# EAGLE schematic 14320^4 (EAGLE 7.6.0)

## Sheet 1 of 2
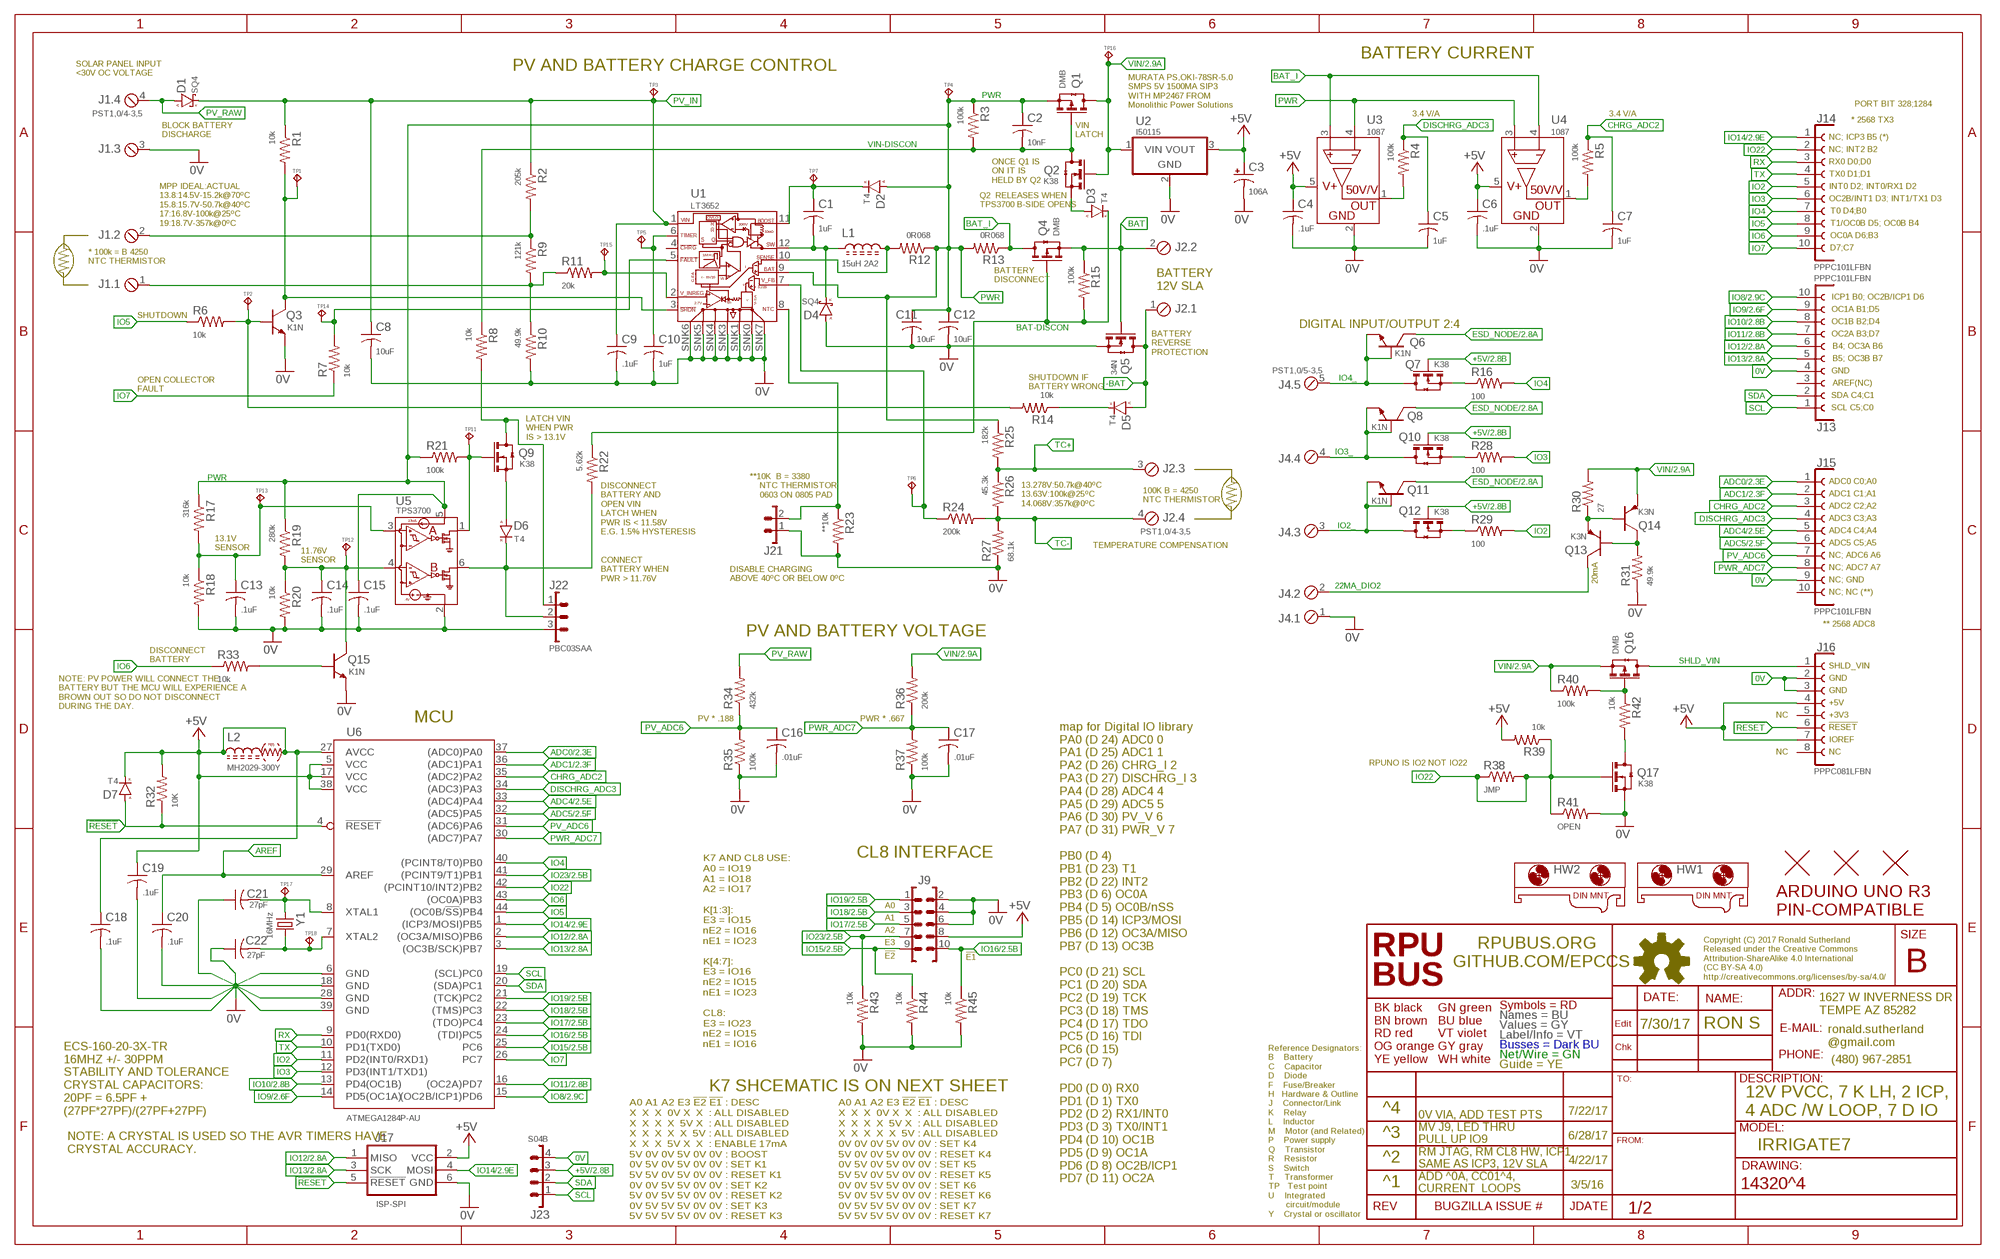
[diagram p0: schematic, sheet 1]

### Parts
C1  1uF  CC0805A  [C0805(2012)]
C2  10nF  CC0603A  [C0603(1608)]
C3  106A  CT1206  [3216]
C4  .1uF  CC0603A  [C0603(1608)]
C5  1uF  CC0805A  [C0805(2012)]
C6  .1uF  CC0603A  [C0603(1608)]
C7  1uF  CC0805A  [C0805(2012)]
C8  10uF  CC1206  [C1206(3216)]
C9  .1uF  CC0805A  [C0805(2012)]
C10  1uF  CC0805A  [C0805(2012)]
C11  10uF  CC1206  [C1206(3216)]
C12  10uF  CC1206  [C1206(3216)]
C13  .1uF  CC0603A  [C0603(1608)]
C14  .1uF  CC0603A  [C0603(1608)]
C15  .1uF  CC0603A  [C0603(1608)]
C16  .01uF  CC0603A  [C0603(1608)]
C17  .01uF  CC0603A  [C0603(1608)]
C18  .1uF  CC0603A  [C0603(1608)]
C19  .1uF  CC0603A  [C0603(1608)]
C20  .1uF  CC0603A  [C0603(1608)]
C21  27pF  CC0603A  [C0603(1608)]
C22  27pF  CC0603A  [C0603(1608)]
D1  SQ4  DSMA  [SMA]
D2  T4  DSOD123  [SOD123]
D3  T4  DSOD123  [SOD123]
D4  SQ4  DSMA  [SMA]
D5  T4  DSOD123  [SOD123]
D6  T4  DSOD123  [SOD123]
D7  T4  DSOD123  [SOD123]
HW1  MOUNT-HOLE5.0  [USA10]
HW2  MOUNT-HOLE5.0  [USA10]
HW3  ARDUINO-UNO  [ARDUINO_UNO]
J1  PST1,0/4-3,5  MCV4  [MCV4]
J2  PST1,0/4-3,5  MCV4  [MCV4]
J4  PST1,0/5-3,5  MCV5  [MCV5]
J9  2X5  [2X5]
J13  PPPC101LFBN  F1X10  [F1X10]
J14  PPPC101LFBN  F1X10  [F1X10]
J15  PPPC101LFBN  F1X10  [F1X10]
J16  PPPC081LFBN  F1X8  [F1X8]
J17  ISP-SPI  ISP-SPIPTH  [ISP]
J21  1X2  [1X2]
J22  PBC03SAA  1X3  [1X3]
J23  S04B  B04B  [B04B]
L1  15uH 2A2  L3939  [L3939]
L2  MH2029-300Y  L0805  [C0805(2012)]
Q1  DMB  N-CHSOT23  [SOT23]
Q2  K38  N-CHSOT23  [SOT23]
Q3  K1N  NPNSOT23  [SOT23]
Q4  DMB  N-CHSOT23  [SOT23]
Q5  34N  N-CHSOT23  [SOT23]
Q6  K1N  NPNSOT23  [SOT23]
Q7  K38  N-CHSOT23  [SOT23]
Q8  K1N  NPNSOT23  [SOT23]
Q9  K38  N-CHSOT23  [SOT23]
Q10  K38  N-CHSOT23  [SOT23]
Q11  K1N  NPNSOT23  [SOT23]
Q12  K38  N-CHSOT23  [SOT23]
Q13  K3N  PNPSOT23  [SOT23]
Q14  K3N  PNPSOT23  [SOT23]
Q15  K1N  NPNSOT23  [SOT23]
Q16  DMB  N-CHSOT23  [SOT23]
Q17  K38  N-CHSOT23  [SOT23]
R1  10k  R0805  [C0805(2012)]
R2  205k  R0805  [C0805(2012)]
R3  100k  R0805  [C0805(2012)]
R4  100k  R0805  [C0805(2012)]
R5  100k  R0805  [C0805(2012)]
R6  10k  R0805  [C0805(2012)]
R7  10k  R0805  [C0805(2012)]
R8  10k  R0805  [C0805(2012)]
R9  121k  R0805  [C0805(2012)]
R10  49.9k  R0805  [C0805(2012)]
R11  20k  R0805  [C0805(2012)]
R12  0R068  R1210  [C1210(3225)]
R13  0R068  R1210  [C1210(3225)]
R14  10k  R0805  [C0805(2012)]
R15  100k  R0805  [C0805(2012)]
R16  100  R0805  [C0805(2012)]
R17  316k  R0805  [C0805(2012)]
R18  10k  R0805  [C0805(2012)]
R19  280k  R0805  [C0805(2012)]
R20  10k  R0805  [C0805(2012)]
R21  100k  R0805  [C0805(2012)]
R22  5.62k  R0805  [C0805(2012)]
R23  **10k  R0805  [C0805(2012)]
R24  200k  R0805  [C0805(2012)]
R25  182k  R0805  [C0805(2012)]
R26  45.3k  R0805  [C0805(2012)]
R27  68.1k  R0805  [C0805(2012)]
R28  100  R0805  [C0805(2012)]
R29  100  R0805  [C0805(2012)]
R30  27  R0805  [C0805(2012)]
R31  49.9k  R0805  [C0805(2012)]
R32  10K  R0805  [C0805(2012)]
R33  10k  R0805  [C0805(2012)]
R34  432k  R0805  [C0805(2012)]
R35  100k  R0805  [C0805(2012)]
R36  200k  R0805  [C0805(2012)]
R37  100k  R0805  [C0805(2012)]
R38  JMP  R0805  [C0805(2012)]
R39  10k  R0805  [C0805(2012)]
R40  100k  R0805  [C0805(2012)]
R41  OPEN  R0805  [C0805(2012)]
R42  10k  R0805  [C0805(2012)]
R43  10k  R0805  [C0805(2012)]
R44  10k  R0805  [C0805(2012)]
R45  10k  R0805  [C0805(2012)]
TP1  TPPAD1-08  [P1-08]
TP2  TPPAD1-08  [P1-08]
TP3  TPPAD1-08  [P1-08]
TP4  TPPAD1-08  [P1-08]
TP5  TPPAD1-08  [P1-08]
TP6  TPPAD1-08  [P1-08]
TP7  TPPAD1-08  [P1-08]
TP11  TPPAD1-08  [P1-08]
TP12  TPPAD1-08  [P1-08]
TP13  TPPAD1-08  [P1-08]
TP14  TPPAD1-08  [P1-08]
TP15  TPPAD1-08  [P1-08]
TP16  TPPAD1-08  [P1-08]
TP17  TPPAD1-08  [P1-08]
TP18  TPPAD1-08  [P1-08]
U1  LT3652  [12MSOP-EDP-HAND]
U2  I50115  OKI-78SR-H  [OKI-78SR-H]
U3  1087  ZXCT1087  [SOT23-5]
U4  1087  ZXCT1087  [SOT23-5]
U5  TPS3700  TPS3700DDCR  [SOT23-6]
U6  ATMEGA1284P-AU  ATMEGA1284-AUTQFP44  [TQFP44]
U$2  FIDUCIAL1.27  [FIDUCIAL-1.27]
U$3  FIDUCIAL1.27  [FIDUCIAL-1.27]
U$4  FIDUCIAL1.27  [FIDUCIAL-1.27]
Y1  16MHz  CSM-3X  [CSM-3X]

### Nets
0V: C3.- C4.2 C5.2 C6.2 C7.2 C8.2 C9.2 C10.2 C11.2 C12.2 C13.2 C14.2 C15.2 C16.2 C17.2 C18.2 C19.2 C20.2 C21.1 C22.1 D4.A J1.3 J4.1 J9.2 J9.4 J9.6 J13.4 J15.9 J16.2 J16.3 J17.6(GND) J21.1 J22.3 J23.4 Q3.E Q5.2(S)(S) Q15.E Q17.2(S)(S) R10.2 R18.2 R20.2 R23.2 R27.1 R31.1 R35.1 R37.1 R41.2 R43.2 R44.2 R45.2 U1.SNK0(0V) U1.SNK1(0V) U1.SNK3(0V) U1.SNK4(0V) U1.SNK5(0V) U1.SNK6(0V) U1.SNK7(0V) U2.2(GND) U3.2(GND) U4.2(GND) U5.2(0V) U6.6(GND) U6.18(GND) U6.28(GND) U6.39(GND) ; also sheet 2
22MA_DIO2: J4.2 Q13.C
!RESET!: D7.A J16.6 J17.5(!RESET) R32.1 U6.4(!RESET)
+5V: C3.+ C4.1 C6.1 C18.1 C19.1 D7.C(K) J9.8 J16.4 J16.7 J17.2(VCC) J23.3 L2.1 L2.2 Q7.1(G)(G) Q10.1(G)(G) Q12.1(G)(G) R32.2 R39.2 U2.3(VOUT) U3.5(VCC) U4.5(VCC) U6.5(VCC) U6.17(VCC) U6.27(AVCC) U6.38(VCC) ; also sheet 2
-BAT: D5.A J2.1 Q5.3(D)(D)
ADC0: J15.1 U6.37((ADC0)PA0) ; also sheet 2
ADC1: J15.2 U6.36((ADC1)PA1) ; also sheet 2
ADC4: J15.5 U6.33((ADC4)PA4) ; also sheet 2
ADC5: J15.6 U6.32((ADC5)PA5) ; also sheet 2
AREF: C20.1 U6.29(AREF)
BAT: J2.2 Q4.2(S)(S) Q5.1(G)(G) R15.1
BAT-DISCON: D3.C(K) Q4.1(G)(G) R15.2 R22.1
BAT_I: Q4.3(D)(D) R13.1 U3.3(S+) U4.4(S-)
CHRG_ADC2: C7.1 J15.3 R5.1 U6.35((ADC2)PA2)
DISCHRG_ADC3: C5.1 J15.4 R4.1 U6.34((ADC3)PA3)
ESD_NODE: Q6.C Q8.C Q11.C ; also sheet 2
IO2: J14.5 R29.2 U6.11(PD2(INT0/RXD1))
IO2_: J4.3 Q11.B Q11.E Q12.3(D)(D)
IO3: J14.6 R28.2 U6.12(PD3(INT1/TXD1))
IO3_: J4.4 Q8.B Q8.E Q10.3(D)(D)
IO4: J14.7 R16.2 U6.40((PCINT8/T0)PB0)
IO4_: J4.5 Q6.B Q6.E Q7.3(D)(D)
IO5: J14.8 R6.1 U6.44((OC0B/!SS!)PB4)
IO6: J14.9 R33.1 U6.43((OC0A)PB3)
IO7: J14.10 R7.1 U6.26(PC7)
IO8: J13.10 U6.15((OC2B/ICP1)PD6) ; also sheet 2
IO9: J13.9 U6.14(PD5(OC1A)) ; also sheet 2
IO10: J13.8 U6.13(PD4(OC1B)) ; also sheet 2
IO11: J13.7 U6.16((OC2A)PD7) ; also sheet 2
IO12: J13.6 J17.1(MISO) U6.2((OC3A/MISO)PB6) ; also sheet 2
IO13: J13.5 J17.3(SCK) U6.3((OC3B/SCK)PB7) ; also sheet 2
IO14: J14.1 J17.4(MOSI) U6.1((ICP3/MOSI)PB5) ; also sheet 2
IO15: J9.9 R44.1 U6.25(PC6) ; also sheet 2
IO16: J9.10 R45.1 U6.24((TDI)PC5) ; also sheet 2
IO17: J9.5 U6.23((TDO)PC4) ; also sheet 2
IO18: J9.3 U6.22((TMS)PC3) ; also sheet 2
IO19: J9.1 U6.21((TCK)PC2) ; also sheet 2
IO22: J14.2 Q17.1(G)(G) R38.1 R38.2 R39.1 R41.1 U6.42((PCINT10/INT2)PB2)
IO23: J9.7 R43.1 U6.41((PCINT9/T1)PB1) ; also sheet 2
N$2: R24.1 TP6.TP U1.7(V_FB)
N$5: Q16.1(G)(G) R40.2 R42.1
N$6: Q17.3(D)(D) R42.2
N$8: R4.2 U3.1(OUT)
N$10: C1.1 D2.C(K) TP7.TP U1.11(BOOST)
N$23: C10.1 TP5.TP U1.6(TIMER)
N$28: R5.2 U4.1(OUT)
N$38: D5.C(K) R14.1
N$39: J1.1 R9.2 R10.1 R11.1
N$40: Q3.C R1.2 TP1.TP U1.3(!SHDN)
N$46: Q3.B R6.2 R14.2 TP2.TP
N$49: Q15.B R33.2
N$54: C14.1 Q15.C R19.2 R20.1 TP12.TP U5.4(INB)
N$55: D3.A Q2.2(S)(S)
N$56: J1.2 R2.2 R9.1
N$57: D6.A Q9.2(S)(S)
N$62: C13.1 R17.2 R18.1 TP13.TP U5.3(INA)
N$63: Q9.1(G)(G) R21.2 TP11.TP U5.1(OUTA)
N$64: D6.C(K) J22.2 R22.2 U5.6(OUTB)
N$65: J22.1 Q9.3(D)(D) R8.2
N$70: R11.2 TP15.TP U1.2(V_INREG)
N$91: Q13.E Q14.B R30.1
N$93: Q10.2(S)(S) R28.1
N$97: Q13.B Q14.C R31.2
N$104: Q7.2(S)(S) R16.1
N$109: R7.2 TP14.TP U1.5(!FAULT)
N$110: Q12.2(S)(S) R29.1
N$115: C21.2 TP17.TP U6.8(XTAL1) Y1.1
N$116: C22.2 TP18.TP U6.7(XTAL2) Y1.2
NTC1: J21.2 R23.1 U1.8(NTC)
PV_ADC6: C16.1 J15.7 R34.1 R35.2 U6.31((ADC6)PA6)
PV_IN: C8.1 C9.1 D1.K R1.1 R2.1 TP3.TP U1.1(VIN)
PV_RAW: D1.A J1.4 R34.2
PWR: C2.1 C11.1 C12.1 C15.1 D2.A Q1.2(S)(S) R3.1 R12.1 R13.2 R17.1 R19.1 R21.1 R25.1 TP4.TP U1.9(BAT) U3.4(S-) U4.3(S+) U5.5(VDD)
PWR_ADC7: C17.1 J15.8 R36.1 R37.2 U6.30((ADC7)PA7)
RX: J14.3 U6.9(PD0(RXD0))
SCL: J13.1 J23.1 U6.19((SCL)PC0)
SDA: J13.2 J23.2 U6.20((SDA)PC1)
SENSE1: L1.2 R12.2 U1.10(SENSE)
SHLD_VIN: J16.1 Q16.3(D)(D)
SW: C1.2 D4.K L1.1 U1.12(SW)
TC+: J2.3 R25.2 R26.1
TC-: J2.4 R24.2 R26.2 R27.2
TX: J14.4 U6.10(PD1(TXD0))
VIN: Q1.3(D)(D) Q2.1(G)(G) Q14.E Q16.2(S)(S) R30.2 R36.2 R40.1 TP16.TP U2.1(VIN) ; also sheet 2
VIN-DISCON: C2.2 Q1.1(G)(G) Q2.3(D)(D) R3.2 R8.1
Unconnected: J13.3 J15.10 J16.5 J16.8 U1.4(!CHRG)

### Notes on the sheet
- BATTERY CURRENT
- PV AND BATTERY CHARGE CONTROL
- SOLAR PANEL INPUT
  <30V OC VOLTAGE
- PORT BIT 328;1284
- MURATA PS,OKI-78SR-5.0
  SMPS 5V 1500MA SIP3
  WITH MP2467 FROM 
  Monolithic Power Solutions
- 3.4 V/A | 3.4 V/A
- * 2568 TX3
- BLOCK BATTERY
  DISCHARGE
- VIN
  LATCH
- NC; ICP3 B5 (*)
- NC; INT2 B2
- RX0 D0;D0
- TX0 D1;D1
- ONCE Q1 IS 
  ON IT IS 
  HELD BY Q2
- INT0 D2; INT0/RX1 D2
- OC2B/INT1 D3; INT1/TX1 D3
- Q2  RELEASES WHEN 
  TPS3700 B-SIDE OPENS
- T0 D4;B0
- MPP IDEAL:ACTUAL
  13.8:14.5V-15.2k@70ºC
  15.8:15.7V-50.7k@40ºC
  17:16.8V-100k@25ºC
  19:18.7V-357k@0ºC
- T1/OC0B D5; OC0B B4
- OC0A D6;B3
- D7;C7
- * 100k = B 4250
  NTC THERMISTOR
- BATTERY
  DISCONNECT
- BATTERY
  12V SLA
- ICP1 B0; OC2B/ICP1 D6
- OC1A B1;D5
- SHUTDOWN
- OC1B B2;D4
- DIGITAL INPUT/OUTPUT 2:4
- OC2A B3;D7
- B4; OC3A B6
- BATTERY
  REVERSE 
  PROTECTION
- B5; OC3B B7
- GND
- AREF(NC)
- SHUTDOWN IF
  BATTERY WRONG
- OPEN COLLECTOR
  FAULT
- SDA C4;C1
- SCL C5;C0
- LATCH VIN
  WHEN PWR 
  IS > 13.1V
- ADC0 C0;A0
- ADC1 C1;A1
- **10K  B = 3380
      NTC THERMISTOR
      0603 ON 0805 PAD
- 100K B = 4250
  NTC THERMISTOR
- 13.278V:50.7k@40ºC 
  13.63V:100k@25ºC
  14.068V:357k@0ºC
- ADC2 C2;A2
- ADC3 C3;A3
- ADC4 C4;A4
- DISCONNECT 
  BATTERY AND 
  OPEN VIN 
  LATCH WHEN 
  PWR IS < 11.58V
  E.G. 1.5% HYSTERESIS
- TEMPERATURE COMPENSATION | ADC5 C5;A5
- 13.1V
  SENSOR
- NC; ADC6 A6
- 11.76V 
  SENSOR
- NC; ADC7 A7
- CONNECT 
  BATTERY WHEN
  PWR > 11.76V
- DISABLE CHARGING
  ABOVE 40ºC OR BELOW 0ºC
- 20mA | NC; GND
- NC; NC (**)
- ** 2568 ADC8
- PV AND BATTERY VOLTAGE
- DISCONNECT 
  BATTERY
- SHLD_VIN
- GND
- GND
- +5V
- NOTE: PV POWER WILL CONNECT THE 
  BATTERY BUT THE MCU WILL EXPERIENCE A
  BROWN OUT SO DO NOT DISCONNECT 
  DURING THE DAY.
- NC | +3V3
- MCU | PV * .188 | PWR * .667
- !RESET
- IOREF
- NC | NC
- RPUNO IS IO2 NOT IO22
- CL8 INTERFACE
- A0
- A1
- A2
- E3
- !E2 | !E1
- 7/30/17 | RON S
- K7 AND CL8 USE:    
  A0 = IO19
  A1 = IO18
  A2 = IO17
  
  K[1:3]:
  E3 = IO15
  nE2 = IO16
  nE1 = IO23
  
  K[4:7]:
  E3 = IO16
  nE2 = IO15
  nE1 = IO23
  
  CL8:
  E3 = IO23
  nE2 = IO15
  nE1 = IO16
- K7 SHCEMATIC IS ON NEXT SHEET
- ^4
- ECS-160-20-3X-TR
  16MHZ +/- 30PPM
  STABILITY AND TOLERANCE
  CRYSTAL CAPACITORS:
  20PF = 6.5PF +
  (27PF*27PF)/(27PF+27PF)
- 7/22/17
- 12V PVCC, 7 K LH, 2 ICP, 
  4 ADC /W LOOP, 7 D IO
- 0V VIA, ADD TEST PTS
- ^3 | 6/28/17
- MV J9, LED THRU
  PULL UP IO9
- IRRIGATE7
- NOTE: A CRYSTAL IS USED SO THE AVR TIMERS HAVE 
  CRYSTAL ACCURACY.
- ^2 | 4/22/17
- RM JTAG, RM CL8 HW, ICP1
  SAME AS ICP3, 12V SLA
- map for Digital IO library
  PA0 (D 24) ADC0 0 
  PA1 (D 25) ADC1 1
  PA2 (D 26) CHRG_I 2
  PA3 (D 27) DISCHRG_I 3
  PA4 (D 28) ADC4 4
  PA5 (D 29) ADC5 5
  PA6 (D 30) PV_V 6
  PA7 (D 31) PWR_V 7
  
  PB0 (D 4)
  PB1 (D 23) T1
  PB2 (D 22) INT2 
  PB3 (D 6) OC0A 
  PB4 (D 5) OC0B/nSS
  PB5 (D 14) ICP3/MOSI
  PB6 (D 12) OC3A/MISO
  PB7 (D 13) OC3B
     
  PC0 (D 21) SCL
  PC1 (D 20) SDA
  PC2 (D 19) TCK
  PC3 (D 18) TMS
  PC4 (D 17) TDO
  PC5 (D 16) TDI
  PC6 (D 15) 
  PC7 (D 7) 
  
  PD0 (D 0) RX0
  PD1 (D 1) TX0
  PD2 (D 2) RX1/INT0
  PD3 (D 3) TX0/INT1
  PD4 (D 10) OC1B
  PD5 (D 9) OC1A
  PD6 (D 8) OC2B/ICP1
  PD7 (D 11) OC2A
- ^1 | 3/5/16
- ADD ^0A, CC01^4, 
  CURRENT  LOOPS
- A0 A1 A2 E3 !E2! !E1! : DESC
   X  X  X  0V X  X  : ALL DISABLED
   X  X  X  X  5V X  : ALL DISABLED
   X  X  X  X  X  5V : ALL DISABLED
   X  X  X  5V X  X  : ENABLE 17mA
   5V 0V 0V 5V 0V 0V : BOOST
   0V 5V 0V 5V 0V 0V : SET K1
   5V 5V 0V 5V 0V 0V : RESET K1
   0V 0V 5V 5V 0V 0V : SET K2
   5V 0V 5V 5V 0V 0V : RESET K2
   0V 5V 5V 5V 0V 0V : SET K3
   5V 5V 5V 5V 0V 0V : RESET K3
- A0 A1 A2 E3 !E2! !E1! : DESC
   X  X  X  0V X  X  : ALL DISABLED
   X  X  X  X  5V X  : ALL DISABLED
   X  X  X  X  X  5V : ALL DISABLED
   0V 0V 0V 5V 0V 0V : SET K4
   5V 0V 0V 5V 0V 0V : RESET K4
   0V 5V 0V 5V 0V 0V : SET K5
   5V 5V 0V 5V 0V 0V : RESET K5
   0V 0V 5V 5V 0V 0V : SET K6
   5V 0V 5V 5V 0V 0V : RESET K6
   0V 5V 5V 5V 0V 0V : SET K7
   5V 5V 5V 5V 0V 0V : RESET K7

## Sheet 2 of 2
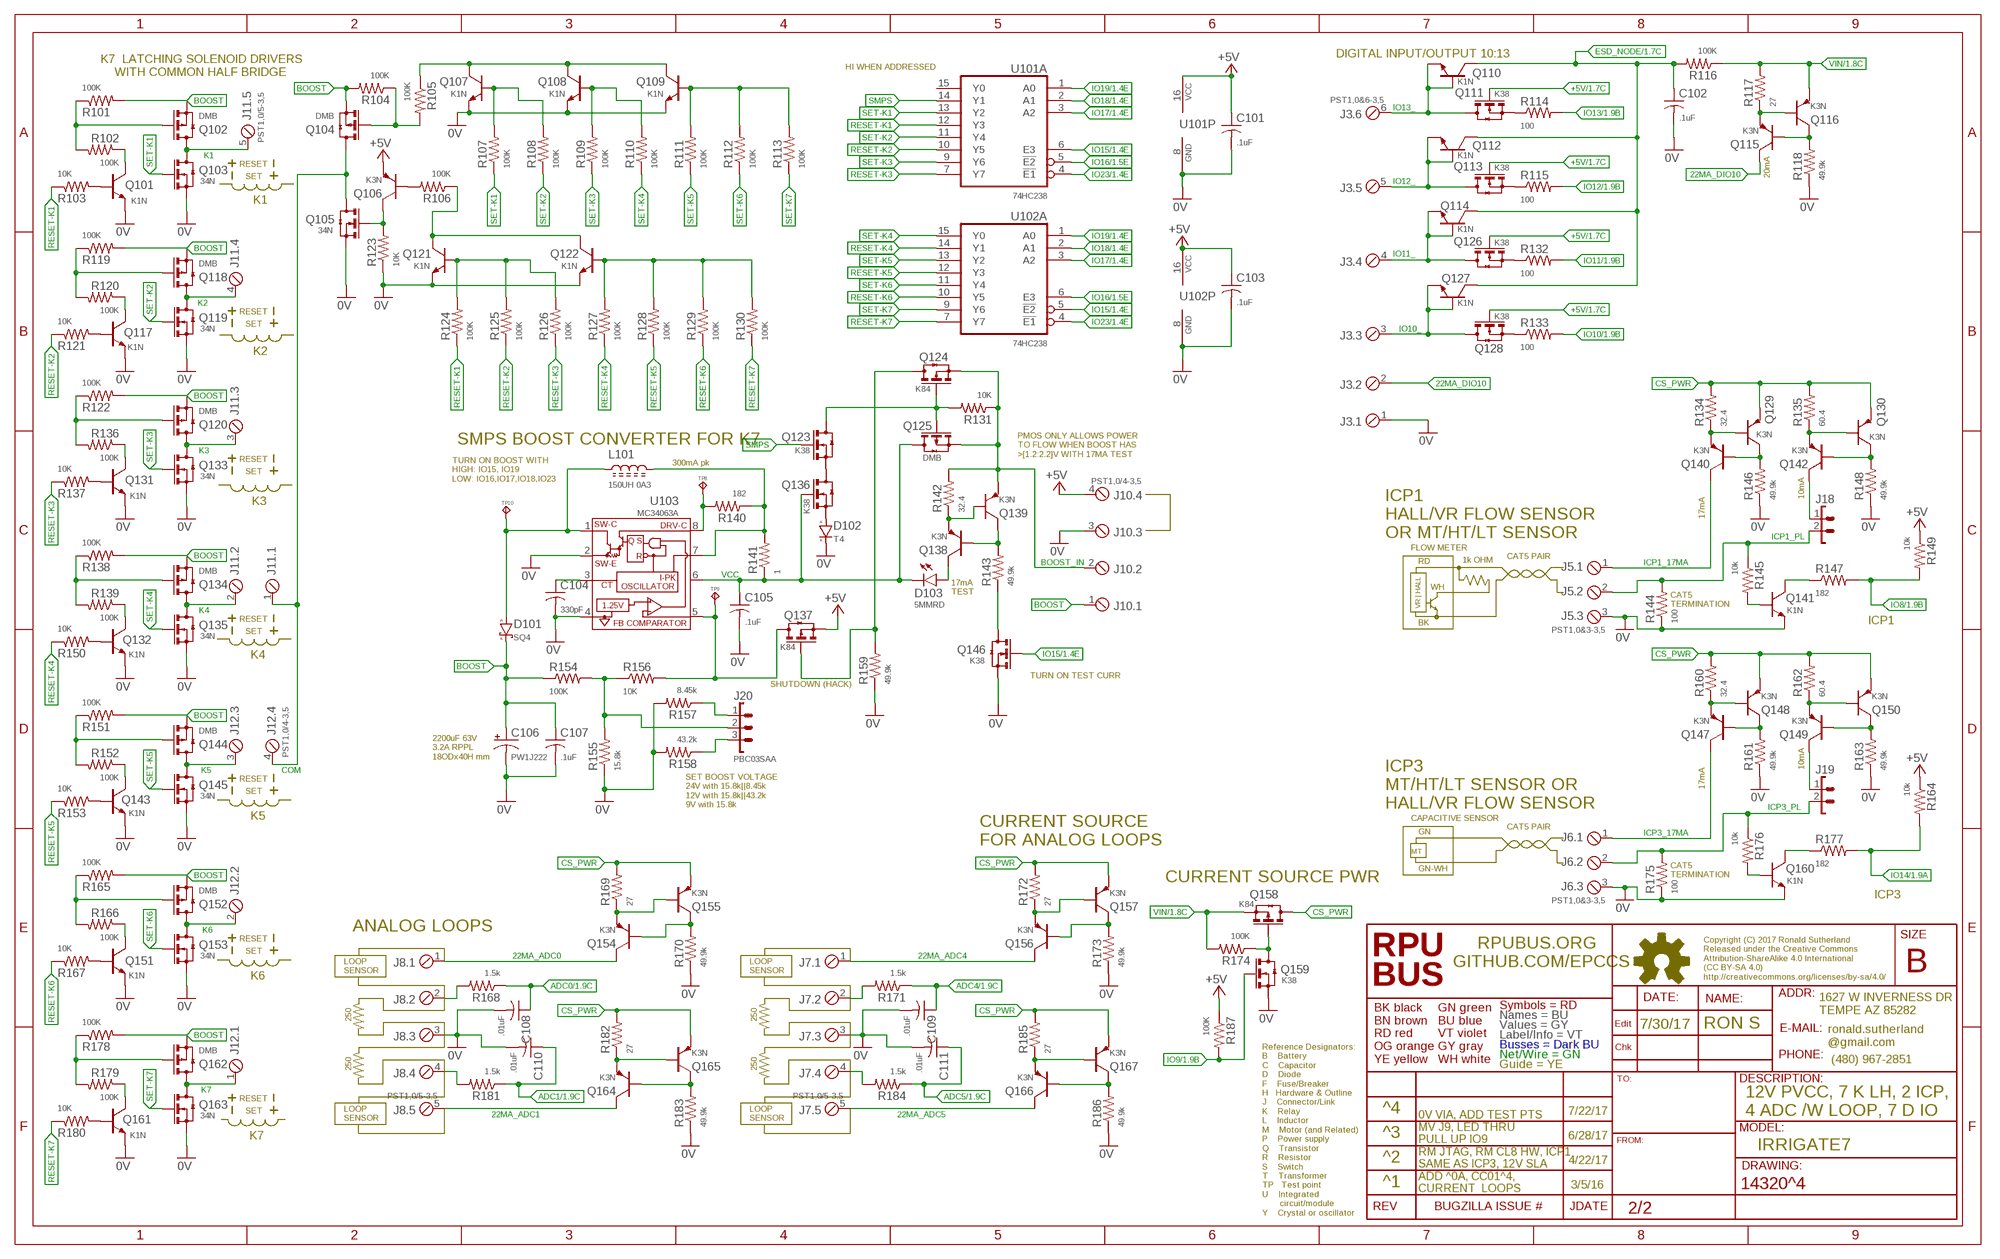
[diagram p1: schematic, sheet 2]

### Parts
C101  .1uF  CC0603A  [C0603(1608)]
C102  .1uF  CC0603A  [C0603(1608)]
C103  .1uF  CC0603A  [C0603(1608)]
C104  330pF  CC0603A  [C0603(1608)]
C105  .1uF  CC0603A  [C0603(1608)]
C106  PW1J222  C-AL7.5X18  [E7,5-18]
C107  .1uF  CC0603A  [C0603(1608)]
C108  .01uF  CC0603A  [C0603(1608)]
C109  .01uF  CC0603A  [C0603(1608)]
C110  .01uF  CC0603A  [C0603(1608)]
C111  .01uF  CC0603A  [C0603(1608)]
D101  SQ4  DSMA  [SMA]
D102  T4  DSOD123  [SOD123]
D103  5MMRD  LED5MM  [LED5MM]
J3  PST1,0&6-3,5  MCV6  [MCV6]
J5  PST1,0&3-3,5  MCV3  [MCV3]
J6  PST1,0&3-3,5  MCV3  [MCV3]
J7  PST1,0/5-3,5  MCV5  [MCV5]
J8  PST1,0/5-3,5  MCV5  [MCV5]
J10  PST1,0/4-3,5  MCV4  [MCV4]
J11  PST1,0/5-3,5  MCV5  [MCV5]
J12  PST1,0/4-3,5  MCV4  [MCV4]
J18  1X2  [1X2]
J19  1X2  [1X2]
J20  PBC03SAA  1X3  [1X3]
L101  150UH 0A3  L2626  [L2626]
Q101  K1N  NPNSOT23  [SOT23]
Q102  DMB  N-CHSOT23  [SOT23]
Q103  34N  N-CHSOT23  [SOT23]
Q104  DMB  N-CHSOT23  [SOT23]
Q105  34N  N-CHSOT23  [SOT23]
Q106  K3N  PNPSOT23  [SOT23]
Q107  K1N  NPNSOT23  [SOT23]
Q108  K1N  NPNSOT23  [SOT23]
Q109  K1N  NPNSOT23  [SOT23]
Q110  K1N  NPNSOT23  [SOT23]
Q111  K38  N-CHSOT23  [SOT23]
Q112  K1N  NPNSOT23  [SOT23]
Q113  K38  N-CHSOT23  [SOT23]
Q114  K1N  NPNSOT23  [SOT23]
Q115  K3N  PNPSOT23  [SOT23]
Q116  K3N  PNPSOT23  [SOT23]
Q117  K1N  NPNSOT23  [SOT23]
Q118  DMB  N-CHSOT23  [SOT23]
Q119  34N  N-CHSOT23  [SOT23]
Q120  DMB  N-CHSOT23  [SOT23]
Q121  K1N  NPNSOT23  [SOT23]
Q122  K1N  NPNSOT23  [SOT23]
Q123  K38  N-CHSOT23  [SOT23]
Q124  K84  N-CHSOT23  [SOT23]
Q125  DMB  N-CHSOT23  [SOT23]
Q126  K38  N-CHSOT23  [SOT23]
Q127  K1N  NPNSOT23  [SOT23]
Q128  K38  N-CHSOT23  [SOT23]
Q129  K3N  PNPSOT23  [SOT23]
Q130  K3N  PNPSOT23  [SOT23]
Q131  K1N  NPNSOT23  [SOT23]
Q132  K1N  NPNSOT23  [SOT23]
Q133  34N  N-CHSOT23  [SOT23]
Q134  DMB  N-CHSOT23  [SOT23]
Q135  34N  N-CHSOT23  [SOT23]
Q136  K38  N-CHSOT23  [SOT23]
Q137  K84  N-CHSOT23  [SOT23]
Q138  K3N  PNPSOT23  [SOT23]
Q139  K3N  PNPSOT23  [SOT23]
Q140  K3N  PNPSOT23  [SOT23]
Q141  K1N  NPNSOT23  [SOT23]
Q142  K3N  PNPSOT23  [SOT23]
Q143  K1N  NPNSOT23  [SOT23]
Q144  DMB  N-CHSOT23  [SOT23]
Q145  34N  N-CHSOT23  [SOT23]
Q146  K38  N-CHSOT23  [SOT23]
Q147  K3N  PNPSOT23  [SOT23]
Q148  K3N  PNPSOT23  [SOT23]
Q149  K3N  PNPSOT23  [SOT23]
Q150  K3N  PNPSOT23  [SOT23]
Q151  K1N  NPNSOT23  [SOT23]
Q152  DMB  N-CHSOT23  [SOT23]
Q153  34N  N-CHSOT23  [SOT23]
Q154  K3N  PNPSOT23  [SOT23]
Q155  K3N  PNPSOT23  [SOT23]
Q156  K3N  PNPSOT23  [SOT23]
Q157  K3N  PNPSOT23  [SOT23]
Q158  K84  N-CHSOT23  [SOT23]
Q159  K38  N-CHSOT23  [SOT23]
Q160  K1N  NPNSOT23  [SOT23]
Q161  K1N  NPNSOT23  [SOT23]
Q162  DMB  N-CHSOT23  [SOT23]
Q163  34N  N-CHSOT23  [SOT23]
Q164  K3N  PNPSOT23  [SOT23]
Q165  K3N  PNPSOT23  [SOT23]
Q166  K3N  PNPSOT23  [SOT23]
Q167  K3N  PNPSOT23  [SOT23]
R101  100K  R0805  [C0805(2012)]
R102  100K  R0805  [C0805(2012)]
R103  10K  R0805  [C0805(2012)]
R104  100K  R0805  [C0805(2012)]
R105  100K  R0805  [C0805(2012)]
R106  100K  R0805  [C0805(2012)]
R107  100K  R0805  [C0805(2012)]
R108  100K  R0805  [C0805(2012)]
R109  100K  R0805  [C0805(2012)]
R110  100K  R0805  [C0805(2012)]
R111  100K  R0805  [C0805(2012)]
R112  100K  R0805  [C0805(2012)]
R113  100K  R0805  [C0805(2012)]
R114  100  R0805  [C0805(2012)]
R115  100  R0805  [C0805(2012)]
R116  100K  R0805  [C0805(2012)]
R117  27  R0805  [C0805(2012)]
R118  49.9k  R0805  [C0805(2012)]
R119  100K  R0805  [C0805(2012)]
R120  100K  R0805  [C0805(2012)]
R121  10K  R0805  [C0805(2012)]
R122  100K  R0805  [C0805(2012)]
R123  10K  R0805  [C0805(2012)]
R124  100K  R0805  [C0805(2012)]
R125  100K  R0805  [C0805(2012)]
R126  100K  R0805  [C0805(2012)]
R127  100K  R0805  [C0805(2012)]
R128  100K  R0805  [C0805(2012)]
R129  100K  R0805  [C0805(2012)]
R130  100K  R0805  [C0805(2012)]
R131  10K  R0805  [C0805(2012)]
R132  100  R0805  [C0805(2012)]
R133  100  R0805  [C0805(2012)]
R134  32.4  R0805  [C0805(2012)]
R135  60.4  R0805  [C0805(2012)]
R136  100K  R0805  [C0805(2012)]
R137  10K  R0805  [C0805(2012)]
R138  100K  R0805  [C0805(2012)]
R139  100K  R0805  [C0805(2012)]
R140  182  R0805  [C0805(2012)]
R141  1  R1210  [C1210(3225)]
R142  32.4  R0805  [C0805(2012)]
R143  49.9k  R0805  [C0805(2012)]
R144  100  R0805  [C0805(2012)]
R145  10k  R0805  [C0805(2012)]
R146  49.9k  R0805  [C0805(2012)]
R147  182  R0805  [C0805(2012)]
R148  49.9k  R0805  [C0805(2012)]
R149  10k  R0805  [C0805(2012)]
R150  10K  R0805  [C0805(2012)]
R151  100K  R0805  [C0805(2012)]
R152  100K  R0805  [C0805(2012)]
R153  10K  R0805  [C0805(2012)]
R154  100K  R0805  [C0805(2012)]
R155  15.8k  R0805  [C0805(2012)]
R156  10K  R0805  [C0805(2012)]
R157  8.45k  R0805  [C0805(2012)]
R158  43.2k  R0805  [C0805(2012)]
R159  49.9k  R0805  [C0805(2012)]
R160  32.4  R0805  [C0805(2012)]
R161  49.9k  R0805  [C0805(2012)]
R162  60.4  R0805  [C0805(2012)]
R163  49.9k  R0805  [C0805(2012)]
R164  10k  R0805  [C0805(2012)]
R165  100K  R0805  [C0805(2012)]
R166  100K  R0805  [C0805(2012)]
R167  10K  R0805  [C0805(2012)]
R168  1.5k  R0805  [C0805(2012)]
R169  27  R0805  [C0805(2012)]
R170  49.9k  R0805  [C0805(2012)]
R171  1.5k  R0805  [C0805(2012)]
R172  27  R0805  [C0805(2012)]
R173  49.9k  R0805  [C0805(2012)]
R174  100K  R0805  [C0805(2012)]
R175  100  R0805  [C0805(2012)]
R176  10k  R0805  [C0805(2012)]
R177  182  R0805  [C0805(2012)]
R178  100K  R0805  [C0805(2012)]
R179  100K  R0805  [C0805(2012)]
R180  10K  R0805  [C0805(2012)]
R181  1.5k  R0805  [C0805(2012)]
R182  27  R0805  [C0805(2012)]
R183  49.9k  R0805  [C0805(2012)]
R184  1.5k  R0805  [C0805(2012)]
R185  27  R0805  [C0805(2012)]
R186  49.9k  R0805  [C0805(2012)]
R187  100K  R0805  [C0805(2012)]
TP8  TPPAD1-08  [P1-08]
TP9  TPPAD1-08  [P1-08]
TP10  TPPAD1-08  [P1-08]
U101  74HC238  74238D  [16SOIC]
U102  74HC238  74238D  [16SOIC]
U103  MC34063A  [SOIC8]

### Nets
0V: C101.2 C102.2 C103.2 C104.2 C105.2 C106.- C107.2 C108.2 C109.2 C110.2 C111.2 D102.C(K) J3.1 J5.3 J6.3 J7.3 J8.3 J10.3 Q101.E Q103.2(S)(S) Q105.2(S)(S) Q107.E Q108.E Q109.E Q117.E Q119.2(S)(S) Q121.E Q122.E Q131.E Q132.E Q133.2(S)(S) Q135.2(S)(S) Q141.E Q143.E Q145.2(S)(S) Q146.2(S)(S) Q151.E Q153.2(S)(S) Q159.2(S)(S) Q160.E Q161.E Q163.2(S)(S) R118.1 R123.1 R144.1 R146.1 R148.1 R155.1 R157.2 R158.2 R159.1 R161.1 R163.1 R170.1 R173.1 R175.1 R183.1 R186.1 U101.8(P:GND) U102.8(P:GND) U103.2(SW-E) U103.4(GND) ; also sheet 1
22MA_ADC0: J8.1 Q154.C
22MA_ADC1: J8.5 Q164.C
22MA_ADC4: J7.1 Q156.C
22MA_ADC5: J7.5 Q166.C
22MA_DIO10: J3.2 Q115.C
+5V: C101.1 C103.1 J10.4 Q106.E Q111.1(G)(G) Q113.1(G)(G) Q126.1(G)(G) Q128.1(G)(G) Q137.2(S)(S) R149.1 R164.1 R187.1 U101.16(P:VCC) U102.16(P:VCC) ; also sheet 1
ADC0: C108.1 R168.1 ; also sheet 1
ADC1: C110.1 R181.1 ; also sheet 1
ADC4: C109.1 R171.1 ; also sheet 1
ADC5: C111.1 R184.1 ; also sheet 1
BOOST: C106.+ C107.1 D101.K J10.1 Q102.2(S)(S) Q104.2(S)(S) Q118.2(S)(S) Q120.2(S)(S) Q134.2(S)(S) Q144.2(S)(S) Q152.2(S)(S) Q162.2(S)(S) R101.2 R104.2 R119.2 R122.2 R138.2 R151.2 R154.1 R165.2 R178.2
BOOST17MA: Q146.3(D)(D) R143.1
BOOST_IN: J10.2 Q124.2(S)(S) Q125.2(S)(S) Q139.E R131.1 R142.2
COM: J11.1 J12.4 Q104.3(D)(D) Q105.3(D)(D)
CS_PWR: Q129.E Q130.E Q148.E Q150.E Q155.E Q157.E Q158.3(D)(D) Q165.E Q167.E R134.2 R135.2 R160.2 R162.2 R169.2 R172.2 R182.2 R185.2
ESD_NODE: C102.1 Q110.C Q112.C Q114.C Q127.C R116.2 ; also sheet 1
ICP1_17MA: J5.1 Q140.C
ICP1_PL: J5.2 J18.2 R144.2 R145.1
ICP3_17MA: J6.1 Q147.C
ICP3_PL: J6.2 J19.2 R175.2 R176.1
IO8: R147.2 R149.2 ; also sheet 1
IO9: Q159.1(G)(G) R187.2 ; also sheet 1
IO10: R133.2 ; also sheet 1
IO10_: J3.3 Q127.B Q127.E Q128.3(D)(D)
IO11: R132.2 ; also sheet 1
IO11_: J3.4 Q114.B Q114.E Q126.3(D)(D)
IO12: R115.2 ; also sheet 1
IO12_: J3.5 Q112.B Q112.E Q113.3(D)(D)
IO13: R114.2 ; also sheet 1
IO13_: J3.6 Q110.B Q110.E Q111.3(D)(D)
IO14: R164.2 R177.2 ; also sheet 1
IO15: Q146.1(G)(G) U101.6(A:E3) U102.5(A:!E2) ; also sheet 1
IO16: U101.5(A:!E2) U102.6(A:E3) ; also sheet 1
IO17: U101.3(A:A2) U102.3(A:A2) ; also sheet 1
IO18: U101.2(A:A1) U102.2(A:A1) ; also sheet 1
IO19: U101.1(A:A0) U102.1(A:A0) ; also sheet 1
IO23: U101.4(A:!E1) U102.4(A:!E1) ; also sheet 1
K1: J11.5 Q102.3(D)(D) Q103.3(D)(D)
K2: J11.4 Q118.3(D)(D) Q119.3(D)(D)
K3: J11.3 Q120.3(D)(D) Q133.3(D)(D)
K4: J11.2 Q134.3(D)(D) Q135.3(D)(D)
K5: J12.3 Q144.3(D)(D) Q145.3(D)(D)
K6: J12.2 Q152.3(D)(D) Q153.3(D)(D)
K7: J12.1 Q162.3(D)(D) Q163.3(D)(D)
N$1: Q123.2(S)(S) Q136.3(D)(D)
N$3: Q124.3(D)(D) Q137.1(G)(G) R159.2
N$4: D102.A Q136.2(S)(S)
N$7: Q137.3(D)(D) R156.2 TP9.TP U103.5(FB)
N$9: Q104.1(G)(G) R104.1 R105.2
N$11: Q154.E Q155.B R169.1
N$12: Q129.B Q140.E R134.1
N$13: R140.2 TP8.TP U103.8(DRV-C)
N$14: L101.2 R140.1 R141.2 U103.7(I-PK)
N$15: D101.A L101.1 TP10.TP U103.1(SW-C)
N$16: C104.1 U103.3(CT)
N$17: Q129.C Q140.B R146.2
N$18: Q130.B Q142.E R135.1
N$19: J19.1 Q149.C
N$20: Q130.C Q142.B R148.2
N$21: Q105.1(G)(G) Q106.C R123.2
N$22: Q123.3(D)(D) Q124.1(G)(G) Q125.1(G)(G) R131.2
N$24: Q154.B Q155.C R170.2
N$25: J8.2 R168.2
N$26: J20.2 R154.2 R155.2 R156.1
N$27: Q107.C Q108.C Q109.C R105.1
N$29: Q109.B R111.2 R112.2 R113.2
N$32: Q108.B R109.2 R110.2
N$35: Q102.1(G)(G) R101.1 R102.2
N$36: Q101.C R102.1
N$37: Q101.B R103.2
N$41: Q141.B R145.2
N$43: Q118.1(G)(G) R119.1 R120.2
N$44: Q117.C R120.1
N$45: Q117.B R121.2
N$47: Q141.C R147.1
N$48: J8.4 R181.2
N$51: Q120.1(G)(G) R122.1 R136.2
N$52: Q131.C R136.1
N$53: Q131.B R137.2
N$59: Q134.1(G)(G) R138.1 R139.2
N$60: Q132.C R139.1
N$61: Q132.B R150.2
N$67: Q144.1(G)(G) R151.1 R152.2
N$68: Q143.C R152.1
N$69: Q143.B R153.2
N$71: Q107.B R107.2 R108.2
N$72: Q106.B R106.2
N$73: Q121.C Q122.C R106.1
N$75: Q152.1(G)(G) R165.1 R166.2
N$76: Q151.C R166.1
N$77: Q151.B R167.2
N$78: J18.1 Q142.C
N$80: Q164.E Q165.B R182.1
N$83: Q162.1(G)(G) R178.1 R179.2
N$84: Q161.C R179.1
N$85: Q161.B R180.2
N$86: D103.A Q138.C
N$87: Q121.B R124.2 R125.2 R126.2
N$89: Q113.2(S)(S) R115.1
N$90: Q164.B Q165.C R183.2
N$92: Q156.E Q157.B R172.1
N$94: Q156.B Q157.C R173.2
N$95: J7.2 R171.2
N$96: J7.4 R184.2
N$98: Q166.E Q167.B R185.1
N$99: Q166.B Q167.C R186.2
N$103: Q158.1(G)(G) Q159.3(D)(D) R174.1
N$105: Q111.2(S)(S) R114.1
N$106: Q126.2(S)(S) R132.1
N$107: Q160.B R176.2
N$108: Q160.C R177.1
N$111: Q128.2(S)(S) R133.1
N$112: Q122.B R127.2 R128.2 R129.2 R130.2
N$114: Q147.E Q148.B R160.1
N$119: Q147.B Q148.C R161.2
N$120: J20.3 R158.1
N$121: J20.1 R157.1
N$122: Q149.E Q150.B R162.1
N$123: Q149.B Q150.C R163.2
N$125: Q115.E Q116.B R117.1
N$126: Q115.B Q116.C R118.2
N$128: Q138.E Q139.B R142.1
N$132: Q138.B Q139.C R143.2
RESET-K1: R103.1 R124.1 U101.12(A:Y3)
RESET-K2: R121.1 R125.1 U101.10(A:Y5)
RESET-K3: R126.1 R137.1 U101.7(A:Y7)
RESET-K4: R127.1 R150.1 U102.14(A:Y1)
RESET-K5: R128.1 R153.1 U102.12(A:Y3)
RESET-K6: R129.1 R167.1 U102.10(A:Y5)
RESET-K7: R130.1 R180.1 U102.7(A:Y7)
SET-K1: Q103.1(G)(G) R107.1 U101.13(A:Y2)
SET-K2: Q119.1(G)(G) R108.1 U101.11(A:Y4)
SET-K3: Q133.1(G)(G) R109.1 U101.9(A:Y6)
SET-K4: Q135.1(G)(G) R110.1 U102.15(A:Y0)
SET-K5: Q145.1(G)(G) R111.1 U102.13(A:Y2)
SET-K6: Q153.1(G)(G) R112.1 U102.11(A:Y4)
SET-K7: Q163.1(G)(G) R113.1 U102.9(A:Y6)
SMPS: Q123.1(G)(G) U101.14(A:Y1)
VCC: C105.1 D103.K Q125.3(D)(D) Q136.1(G)(G) R141.1 U103.6(VCC)
VIN: Q116.E Q158.2(S)(S) R116.1 R117.2 R174.2 ; also sheet 1
Unconnected: U101.15(A:Y0)

### Notes on the sheet
- DIGITAL INPUT/OUTPUT 10:13
- HI WHEN ADDRESSED
- K7  LATCHING SOLENOID DRIVERS
      WITH COMMON HALF BRIDGE
- RESET
- SET | 20mA
- K1
- RESET
- SET
- K2
- SMPS BOOST CONVERTER FOR K7
- PMOS ONLY ALLOWS POWER 
  TO FLOW WHEN BOOST HAS 
  >[1.2:2.2]V WITH 17MA TEST
- RESET
- 300mA pk
- SET
- TURN ON BOOST WITH
  HIGH: IO15, IO19
  LOW: IO16,IO17,IO18,IO23
- 10mA
- K3
- 17mA
- ICP1
  HALL/VR FLOW SENSOR
  OR MT/HT/LT SENSOR
- FLOW METER
- CAT5 PAIR
- RD | 1k OHM
- WH
- 17mA
  TEST
- CAT5 
  TERMINATION
- VR | HALL
- RESET
- BK | ICP1
- SET
- K4
- TURN ON TEST CURR
- SHUTDOWN (HACK)
- 2200uF 63V
  3.2A RPPL
  18ODx40H mm
- 10mA
- RESET
- 17mA
- SET
- SET BOOST VOLTAGE
  24V with 15.8k||8.45k
  12V with 15.8k||43.2k
  9V with 15.8k
- ICP3
  MT/HT/LT SENSOR OR
  HALL/VR FLOW SENSOR
- K5 | CAPACITIVE SENSOR
- CAT5 PAIR
- GN
- CURRENT SOURCE
  FOR ANALOG LOOPS
- MT
- GN-WH
- CAT5 
  TERMINATION
- CURRENT SOURCE PWR
- ICP3
- ANALOG LOOPS
- RESET
- SET
- LOOP 
  SENSOR
- LOOP 
  SENSOR
- K6
- 250 | 250
- 7/30/17 | RON S
- 250 | 250
- RESET
- SET | ^4 | 7/22/17
- 12V PVCC, 7 K LH, 2 ICP, 
  4 ADC /W LOOP, 7 D IO
- 0V VIA, ADD TEST PTS
- LOOP 
  SENSOR
- LOOP 
  SENSOR
- K7 | ^3 | 6/28/17
- MV J9, LED THRU
  PULL UP IO9
- IRRIGATE7
- ^2 | 4/22/17
- RM JTAG, RM CL8 HW, ICP1
  SAME AS ICP3, 12V SLA
- ^1 | 3/5/16
- ADD ^0A, CC01^4, 
  CURRENT  LOOPS

## Library data of the parts
C1 C2 C4-C22 C101-C105 C107-C111 = C-C:C: CAPACITOR Symbol
C3 = C-T:CT: Tantalum Electrolytic Capacitor
C106 = C-Al:C-AL: Aluminum Electrolytic Capacitors PW1J222 [NICHICON,UPW1J222MHD] CAP ALUM 63V 2200UF 20% RADIAL
D1 D4 D101 = D-SBR:D: DIODE
D2 D3 D5-D7 D102 = D-GP:D: DIODE
D103 = D-LED:LED: LED 120120WH [CREE,XHGAWT-00-0000-00000HXE1] LED WHITE 6500K 150LUM-W120120
HW1 HW2 = HW-DINMnt:MOUNT-HOLE: USA10-4.6 [PhxCont,1202713] DINRAIL ADAPTER UNIVERSAL 10MM 4.6MM
HW3 = J-BoardHDR:ARDUINO-UNO: Board Outline with holes and silk note the board dim layer is not defined
J1 J2 J10 J12 = J-HDR3.5mm:MCV4: MCV 1,5/4-G-3,5-RN [PHOENIX CONTACT,1843622] CONN HEADER SHROUDED 2POS 3.5MM PST 1,0/4-3,5 [PHOENIX CONTACT,1945119] CONN HEADER STRIP PIN 4POS 3.5MM MCVR 1,5& 4-ST-3,5 [PHOENIX CONTACT,1863178] CONN PLUG 4POS SCREW 3.5MM
J3 = J-HDR3.5mm:MCV6: MCV 1,5/6-G-3,5 [PHOENIX CONTACT,1843648] CONN HEADER SHROUDED 6POS 3.5MM MCVR 1,5/6-ST-3,5 [PHOENIX CONTACT,1863194] CONN PLUG 6POS SCREW 3.5MM PST 1,0/6-3,5 [PHOENIX CONTACT,1945135] CONN HEADER STRIP PIN 6POS 3.5MM PT 1,5/6-PVH-3,5 [PHOENIX CONTACT,1984057] CONN PLUG STRIP 6POS 3.5MM Drill Size 3/64": .0469" (1.2mm)
J4 J7 J8 J11 = J-HDR3.5mm:MCV5: MCV 1,5/5-G-3,5-RN [PHOENIX CONTACT,1843635] CONN HEADER SHROUDED 5POS 3.5MM MCVR 1,5/5-ST-3,5 [PHOENIX CONTACT,1863181] CONN PLUG 5POS SCREW 3.5MM PST 1,0/5-3,5 [PHOENIX CONTACT,1945122] CONN HEADER STRIP PIN 5POS 3.5MM PT 1,5/5-PVH-3,5 [PHOENIX CONTACT,1984044] CONN PLUG STRIP 4POS 3.5MM Drill Size 3/64": .0469" (1.2mm)
J5 J6 = J-HDR3.5mm:MCV3: MCV 1,5/ 3-G-3,5-RN [PHOENIX CONTACT,1731484] CONN HEADER SHROUDED 3POS 3.5MM MCVR 1,5/ 3-ST-3,5 [PHOENIX CONTACT,1863165] CONN PLUG 3POS SCREW 3.5MM PST 1,0/3-3,5 [PHOENIX CONTACT,1945106] CONN HEADER STRIP PIN 3POS 3.5MM PT1,5&3-PVH-3,5 [PHOENIX CONTACT,1984028] CONN PLUG STRIP 3POS 3.5MM
J9 = J-HDR2.54mm:2X5: 2 X 5 POS HEADER
J13-J15 = J-HDR2.54mm:F1X10: FEMALE HEADER 10POS
J16 = J-HDR2.54mm:F1X8: FEMALE HEADER 8POS
J17 = U-AVR:ISP-SPI: AVR ISP thru SPI In-System Programming uses the target Atmel AVR’s internal SPI (Serial Peripheral Interface) to download code into the flash and EEPROM memories. It is not a debugging interface. When designing an application PCB which includes an AVR with the SPI interface, this pinout should be used. Sparkfun SKU: BOB-08508
J18 J19 J21 = J-HDR2.54mm:1X2
J20 J22 = J-HDR2.54mm:1X3: 6 POS HEADER PBC03SAAN [SULLINS,PBC03SAAN]HEADER MALE BRKWAY 3POS .1IN AA
J23 = J-HDR2mm:B04B: B04B [JST@B04B-PASK] CONN HEADER VERT THRU 4POS S04B [JST@S04B-PASK] CONN HEADER SIDE THRU 4POS
L1 = L-PSMD:L: Inductor
L2 = L-FB:L: Ferrite Bead with frequency dependent resistance
L101 = L-PWR:L: Inductor
Q1 Q4 Q16 Q102 Q104 Q118 Q120 Q124 Q125 Q134 Q137 Q144 Q152 Q158 Q162 = Q-PCH:N-CH?*: ENHANCEMENT MODE MOSFET SOT23 is BSS138 pinout
Q2 Q5 Q7 Q9 Q10 Q12 Q17 Q103 Q105 Q111 Q113 Q119 Q123 Q126 Q128 Q133 Q135 Q136 Q145 Q146 Q153 Q159 Q163 = Q-NCH:N-CH?*: ENHANCEMENT MODE MOSFET SOT23 is BSS138 pinout
Q3 Q6 Q8 Q11 Q15 Q101 Q107-Q110 Q112 Q114 Q117 Q121 Q122 Q127 Q131 Q132 Q141 Q143 Q151 Q160 Q161 = Q-NPN:NPN: BJT NPN General Purpose Amplifier
Q13 Q14 Q106 Q115 Q116 Q129 Q130 Q138-Q140 Q142 Q147-Q150 Q154-Q157 Q164-Q167 = Q-PNP:PNP: BJT NPN General Purpose Amplifier
R1-R45 R101-R187 = R-C:R: Resiistor American-style symbol
TP1-TP18 = J-TP:TP: Test pad
U1 = U-BUCK:LT3652: 3652 [LINEAR,LT3652EMSE] BUCK BATT CHARGE CONTROLLER 12MSOP
U2 = P-DCDC:OKI-78SR: OKI-78SR OKI-78SR-5/1.5-W36H-C 5V@1.5A Horizontal Mount OKI-78SR-5/1.5-W36-C 5V@1.5A Vert Mount OKI-78SR-3.3/1.5-W36H-C 3.3V@1.5A Horizontal Mount OKI-78SR-3.3/1.5-W36-C 3.3V@1.5A Vert Mount Murata Power Solutions 7 to 36 VDC input range need to verify pinout
U3 U4 = U-Linear:ZXCT1087: 1087 [DIODES,ZXCT1087E5TA] HISIDE CURRENT MONITOR SOT23-5
U5 = U-Linear:TPS3700: PXVQ [TI,TPS3700DDCR] WINDOW COMPARATOR 6SOT
U6 = U-AVR:ATMEGA1284-AU: ATmega1284 128 Kbytes FLASH 16 kbytes SRAM 4 kbytes EEPROM 2 USART 8-channel 10 bit ADC
U101 U102 = U-7400:74*238: non-Inverting Logic 3- to 8-Line Decoder/Demultiplexer see 74138 for Inverting
U103 = U-Boost:MC34063A
U$2-U$4 = H-Fiducial:FIDUCIAL: Fiducial Alignment Points Various fiducial points for machine vision alignment.
Y1 = Y-XTL:CSM: 16MHZ20 [ECS,ECS-160-20-3X-TR] CRYSTAL 16MHZ 20PF 30PPM CSM-3X

## Net classes
0 default: width 0.254 mm, drill 0.33 mm